# Altium schematic sheet mcu.SchDoc: Test
size A4; DrawnBy: Łukasz Przeniosło; Organization: Apptimia sp. z o.o.; Address1: Wojska Polskiego 184c/4; Address2: 71-256 Szczecin; Address3: www.apptimia.com; DocumentNumber: 9; Revision: 1; SheetNumber: 9; SheetTotal: 12
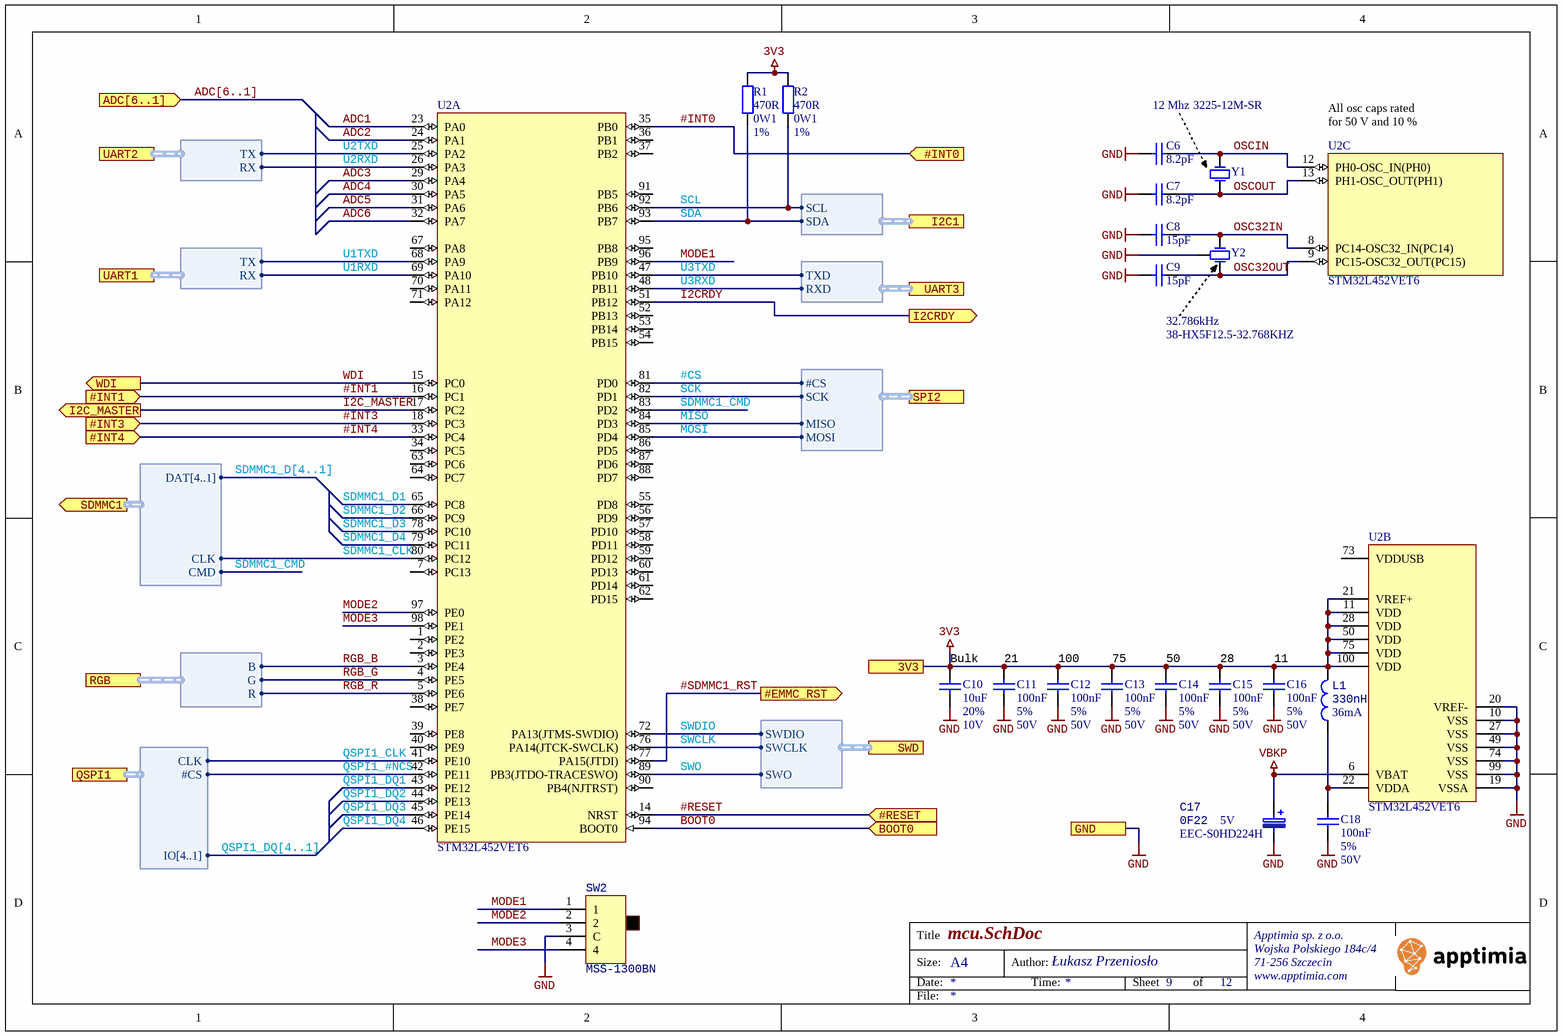
[diagram p0: mcu.SchDoc]

## Parts
C6  8.2pF  [CAPC1608N]
C7  8.2pF  [CAPC1608N]
C8  15pF  [CAPC1608N]
C9  15pF  [CAPC1608N]
C10  10uF  Tolerance: 20%  Voltage: 10V  [CAPC1608N]
C11  100nF  Tolerance: 5%  Voltage: 50V  [CAPC1608N]
C12  100nF  Tolerance: 5%  Voltage: 50V  [CAPC1608N]
C13  100nF  Tolerance: 5%  Voltage: 50V  [CAPC1608N]
C14  100nF  Tolerance: 5%  Voltage: 50V  [CAPC1608N]
C15  100nF  Tolerance: 5%  Voltage: 50V  [CAPC1608N]
C16  100nF  Tolerance: 5%  Voltage: 50V  [CAPC1608N]
C17  0F22  manid: EEC-S0HD224H  Voltage: 5V  [CAP_SD]
C18  100nF  Tolerance: 5%  Voltage: 50V  [CAPC1608N]
L1  330nH  Current: 36mA  [INDC1608N]
R1  470R  Power: 0W1  Tolerance: 1%  [RESC1608N]
R2  470R  Power: 0W1  Tolerance: 1%  [RESC1608N]
SW2  MSS-1300BN  [MSS-1300BN]
U2  STM32L452VET6  [LQFP100_L]  (parts A,B,C of 3)
Y1  3225-12M-SR  value 12 Mhz  [3325]
Y2  38-HX5F12.5-32.768KHZ  value 32.786kHz  [XTAL_32k_pad]

## Ports
3V3, #EMMC_RST (out), #INT0 (in), #INT1 (in), #INT3 (in), #INT4 (in), #RESET (in), ADC[6..1] (in), BOOT0 (in), GND, I2C1 (harness I2C1), I2C_MASTER (out), I2CRDY (out), QSPI1 (harness QSPI1), RGB (harness RGB), SDMMC1 (out, harness SDMMC1), SPI2 (harness SPI2), SWD (harness SWD), UART1 (harness UART1), UART2 (harness UART2), UART3 (harness UART3), WDI (out)

## Harnesses
UART2: TX, RX
I2C1: SDA, SCL
QSPI1: CLK, #CS, IO[4..1]
UART3: TXD, RXD
SWD: SWCLK, SWDIO, SWO
UART1: RX, TX
RGB: B, G, R
SPI2: MOSI, MISO, SCK, #CS
SDMMC1: CLK, CMD, DAT[4..1]

## Nets
3V3: C10.2 C11.2 C12.2 C13.2 C14.2 C15.2 C16.2 L1.1 R1.2 R2.2 U2.11(VDD) U2.21(VREF+) U2.28(VDD) U2.50(VDD) U2.75(VDD) U2.100(VDD) ; port 3V3
GND: C6.2 C7.2 C8.2 C9.2 C10.1 C11.1 C12.1 C13.1 C14.1 C15.1 C16.1 C17.2 C18.1 SW2.3(C) U2.10(VSS) U2.19(VSSA) U2.20(VREF-) U2.27(VSS) U2.49(VSS) U2.74(VSS) U2.99(VSS) Y2.3(PAD) ; port GND
VBKP: C17.1 U2.6(VBAT)
#CS: U2.81(PD0) ; port SPI2.#CS
#INT0: U2.35(PB0) ; port #INT0
#INT1: U2.16(PC1) ; port #INT1
#INT3: U2.18(PC3) ; port #INT3
#INT4: U2.33(PC4) ; port #INT4
#RESET: U2.14(NRST) ; port #RESET
#SDMMC1_RST: U2.77(PA15(JTDI)) ; port #EMMC_RST
ADC1: U2.23(PA0)
ADC2: U2.24(PA1)
ADC3: U2.29(PA4)
ADC4: U2.30(PA5)
ADC5: U2.31(PA6)
ADC6: U2.32(PA7)
BOOT0: U2.94(BOOT0) ; port BOOT0
I2C_MASTER: U2.17(PC2) ; port I2C_MASTER
I2CRDY: U2.51(PB12) ; port I2CRDY
MISO: U2.84(PD3) ; port SPI2.MISO
MODE1: SW2.1 U2.96(PB9)
MODE2: SW2.2 U2.97(PE0)
MODE3: SW2.4 U2.98(PE1)
MOSI: U2.85(PD4) ; port SPI2.MOSI
OSC32IN: C8.1 U2.8(PC14-OSC32_IN(PC14)) Y2.2(OSC2)
OSC32OUT: C9.1 U2.9(PC15-OSC32_OUT(PC15)) Y2.1(OSC1)
OSCIN: C6.1 U2.12(PH0-OSC_IN(PH0)) Y1.3(OSC2)
OSCOUT: C7.1 U2.13(PH1-OSC_OUT(PH1)) Y1.1(OSC1)
QSPI1_#NCS: U2.42(PE11) ; port QSPI1.#CS
QSPI1_CLK: U2.41(PE10) ; port QSPI1.CLK
QSPI1_DQ1: U2.43(PE12)
QSPI1_DQ2: U2.44(PE13)
QSPI1_DQ3: U2.45(PE14)
QSPI1_DQ4: U2.46(PE15)
RGB_B: U2.3(PE4) ; port RGB.B
RGB_G: U2.4(PE5) ; port RGB.G
RGB_R: U2.5(PE6) ; port RGB.R
SCK: U2.82(PD1) ; port SPI2.SCK
SCL: R2.1 U2.92(PB6) ; port I2C1.SCL
SDA: R1.1 U2.93(PB7) ; port I2C1.SDA
SDMMC1_CLK: U2.80(PC12) ; port SDMMC1.CLK
SDMMC1_CMD: U2.83(PD2) ; port SDMMC1.CMD
SDMMC1_D1: U2.65(PC8)
SDMMC1_D2: U2.66(PC9)
SDMMC1_D3: U2.78(PC10)
SDMMC1_D4: U2.79(PC11)
SWCLK: U2.76(PA14(JTCK-SWCLK)) ; port SWD.SWCLK
SWDIO: U2.72(PA13(JTMS-SWDIO)) ; port SWD.SWDIO
SWO: U2.89(PB3(JTDO-TRACESWO)) ; port SWD.SWO
U1RXD: U2.69(PA10) ; port UART1.RX
U1TXD: U2.68(PA9) ; port UART1.TX
U2RXD: U2.26(PA3) ; port UART2.RX
U2TXD: U2.25(PA2) ; port UART2.TX
U3RXD: U2.48(PB11) ; port UART3.RXD
U3TXD: U2.47(PB10) ; port UART3.TXD
WDI: U2.15(PC0) ; port WDI
NetC18_2: C18.2 L1.2 U2.22(VDDA)

Not connected (* = marked no-connect by the designer): U2 1(PE2) 2(PE3) 7(PC13) 34(PC5) 36(PB1) 37(PB2) 38(PE7) 39(PE8) 40(PE9) 52(PB13) 53(PB14) 54(PB15) 55(PD8) 56(PD9) 57(PD10) 58(PD11) 59(PD12) 60(PD13) 61(PD14) 62(PD15) 63(PC6) 64(PC7) 67(PA8) 70(PA11) 71(PA12) 73(VDDUSB) 86(PD5) 87(PD6) 88(PD7) 90(PB4(NJTRST)) 91(PB5) 95(PB8); Y1 2 4

## Buses and harness runs
bus ADC[6..1] = port ADC[6..1]
bus QSPI1_DQ[4..1]
bus SDMMC1_D[4..1]

## Notes on the sheet
- (near U2) All osc caps rated for 50 V and 10 %
- (near C10) Bulk
- (near C11) 21
- (near C12) 100
- (near C13) 75
- (near C14) 50
- (near C15) 28
- (near C16) 11
- Title
- Size:
- Date:
- A4
- Author:
- Time:
- Sheet
- of
- File:

## Library data of the parts
C6-C9 = Capacitor: Tolerance: 10%; Voltage: 50V
  C6 C7: Value: 8.2pF
  C8 C9: Value: 15pF
C10-C16 C18 = Capacitor
  C10: Value: 10uF
  C11-C16 C18: Value: 100nF
C17 = cap_electro: Tolerance: 30%; Value: 0F22
L1 = Inductor: Impedance_100Mhz: 220R; Value: 330nH
R1 R2 = Resistor: Value: 470R
SW2 = MSS-1300BN: Przełącznik: suwakowy; 3-pozycyjne; SP3T; 0,3A/4VDC; OFF-ON-ON
U2 = STM32L452V: Ultra-Low-Power ARM Cortex-M4 32-bit MCU+FPU, 512 KB Flash, 128 KB Internal RAM, 82 I/Os, 100-Pin LQFP, -40 to 85 degC, Tray; Supply Voltage(Vcc) min (V): 1.71; Operating Frequency(F) (Processor speed) (MHz): 80; I/Os (High Current): 82; FLASH Size (Prog) (kB): 512; Internal RAM Size (kB): 128; D/A Converter: 2; Package Reference: LQFP100; ComponentLink1Description: Manufacturer URL; DatasheetVersion: Rev. 4; ComponentLink1URL: http://www.st.com/; Core: ARM Cortex-M4; ComponentLink2URL: http://www.st.com/st-web-ui/static/active/en/resource/technical/document/datasheet/DM00108832.pdf; Package Description: 100-Pin Low Profile Quad Flat Package, Body 14 x 14 mm, Pitch 0.5 mm; Mounting Technology: Surface Mount; ComponentLink2Description: Datasheet; Packing: Tray; PartId: 1; manid: STM32L452VET6
Y1 = Crystal4: Rezonator: kwarcowy; manid: 3225-12M-SR
Y2 = XTAL_PAD: Crystal Oscillator; manid: 38-HX5F12.5-32.768KHZ